# EAGLE design CircuitDiagram (EAGLE 9.3.0)
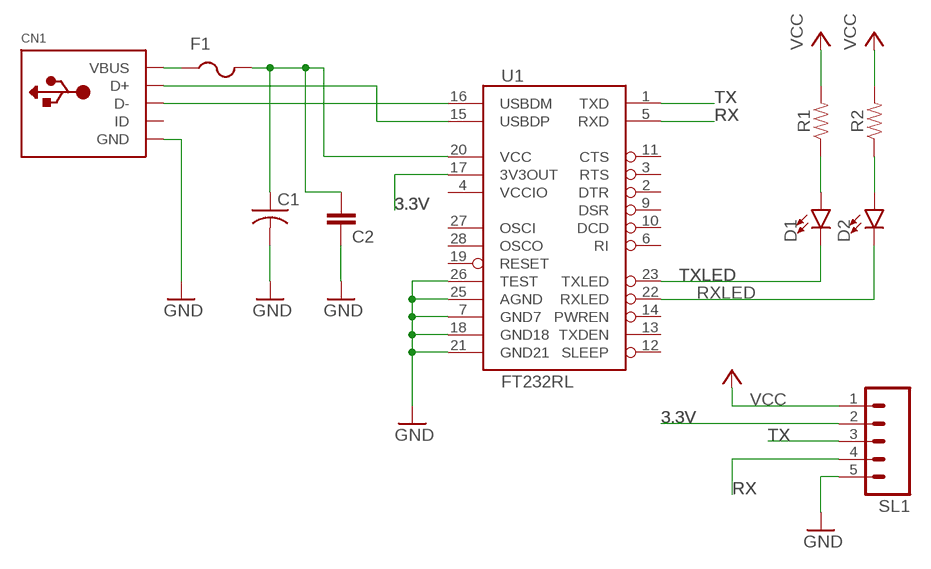
[diagram p0: schematic, sheet 1]

## Parts
C1  C-USC1206  [C1206]
C2  1.0uF  1.0UF-1206-50V-10%  [1206]
CN1  USBMINIB  [USB-MINIB]
D1  LED1206  [LED-1206]
D2  LED1206  [LED-1206]
F1  PTCFUSE-1206  [R1206]
R1  RESISTOR1206  [1206]
R2  RESISTOR1206  [1206]
SL1  M05  [05P]
U1  FT232RL  FT232RLSSOP  [SSOP28DB]

## Nets
3.3V: SL1.2 U1.17(3V3OUT)
GND: C1.2 C2.2 CN1.GND SL1.5 U1.7(GND7) U1.18(GND18) U1.21(GND21) U1.25(AGND) U1.26(TEST)
N$1: CN1.VBUS F1.1
N$2: C1.1 C2.1 F1.2 U1.20(VCC)
N$4: CN1.D- U1.16(USBDM)
N$5: CN1.D+ U1.15(USBDP)
N$6: D1.A R1.1
N$8: D2.A R2.1
RX: SL1.4 U1.5(RXD)
RXLED: D2.C U1.22(RXLED)
TX: SL1.3 U1.1(TXD)
TXLED: D1.C U1.23(TXLED)
VCC: R1.2 R2.2 SL1.1
Unconnected: CN1.ID U1.2(DTR) U1.3(RTS) U1.6(RI) U1.9(DSR) U1.10(DCD) U1.11(CTS) U1.12(SLEEP) U1.13(TXDEN) U1.14(PWREN) U1.19(RESET) U1.27(OSCI) U1.28(OSCO)

## Power pins joined to a net without a drawn wire
VCCIO: U1.4(VCCIO)

## Library data of the parts
C1 = adafruit:C-US: CAPACITOR, American symbol
C2 = SparkFun-Capacitors:1.0UF: 1µF ceramic capacitors A capacitor is a passive two-terminal electrical component used to store electrical energy temporarily in an electric field.; PROD_ID: CAP-09822
CN1 = adafruit:USB: USB Connectors USBMINIB - Surface Mount Female Mini-B USB Connector 4UConnector: 06564 By microbuilder.eu Thru-hole RA Female Mini-B USB Connector 4UConnector: 18732 By ladyada.net
D1 D2 = SparkFun-LED:LED: LED (Generic) Standard schematic elements and footprints for 5mm, 3mm, 1206, and 0603 sized LEDs. Generic LEDs with no color specified.
F1 = adafruit:PTCFUSE: PTC fuses, resettable thermistors
R1 R2 = SparkFun-Resistors:RESISTOR: Generic Resistor Package
SL1 = con-amp-quick:M05: AMP QUICK CONNECTOR; OC_FARNELL: unknown; OC_NEWARK: unknown
U1 = SparkFun-IC-Comms:FT232RL: FT232RL USB UART FT232RL 4th Generation USB UART (USB <-> Serial) Controller. Datasheet <http://www.sparkfun.com/datasheets/IC/FT232R_v104.pdf> SparkFun Products Component <https://www.sparkfun.com/products/650> (COM-00650) SparkFun RedBot Mainboard <https://www.sparkfun.com/products/12097> (ROB-12097) SparkFun FTDI Basic Breakout - 5V <https://www.sparkfun.com/products/9716> (DEV-09716) SparkFun FTDI Basic Breakout - 3.3V <https://www.sparkfun.com/products/9873> (DEV-09873) Bus Pirate - v3.6a <https://www.sparkfun.com/products/12942> (TOL-12942) SparkFun USB to Serial Breakout - FT232RL <https://www.sparkfun.com/products/12731> (BOB-12731) SparkFun PicoBoard <https://www.sparkfun.com/products/11888> (WIG-11888) SparkFun RFID USB Reader <https://www.sparkfun.com/products/9963> (SEN-09963) LilyPad FTDI Basic Breakout - 5V <https://www.sparkfun.com/products/10275> (DEV-10275) SparkFun Stepoko <https://www.sparkfun.com/products/13899> (ROB-13899); PROD_ID: IC-00870

## Board
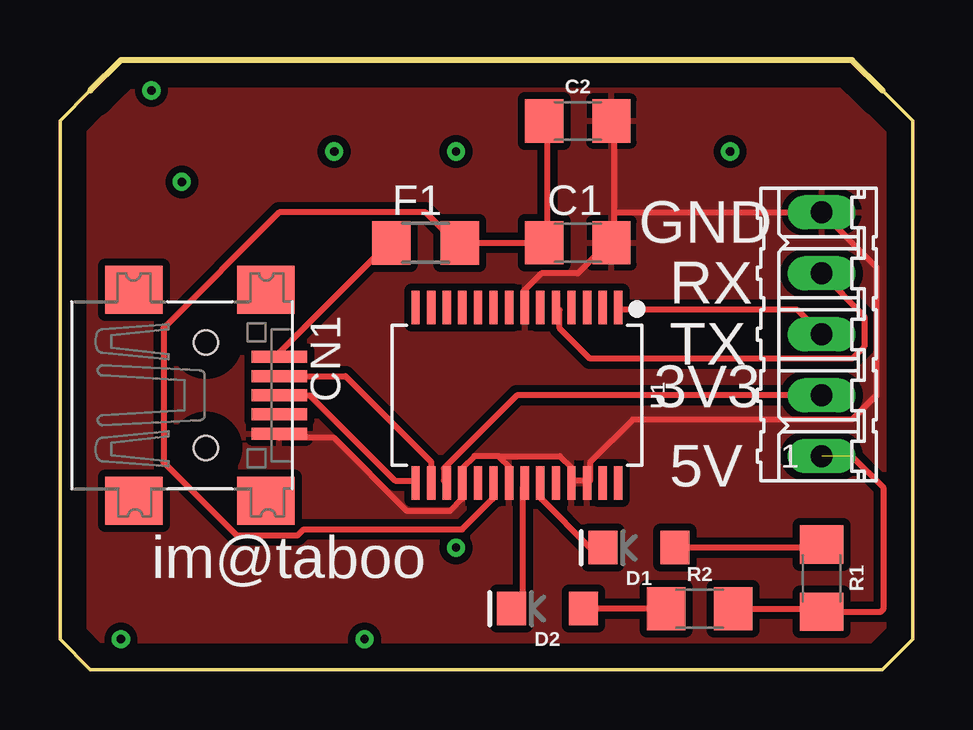
[diagram p1: board, top side]

Size 35.56 x 25.4 mm. Coordinates in mm from the lower left corner, seen from the top.
Outline: 0,22.86 0,1.27 1.27,0 34.29,0 35.56,1.27 35.56,22.86 34.29,24.13 33.02,25.4 2.54,25.4 1.27,24.13 0,22.86
Copper layers (1*16): Top 0.035mm / dielectric 1.5mm / Bottom 0.035mm
Design rules "default *": minimum track width 10mil, minimum drill 0.35mm, track to track 10mil, track to pad 6mil, pad to pad 6mil, via to via 6mil, smd to smd 6mil, copper to edge 40mil, drill to drill 6mil, minimum pad ring 10mil, minimum via ring 8mil, stop-mask expansion 4mil, vias tented up to drill 0mil, thermal gap 10mil

### Footprints (pad centres in the part's own frame; a part is rotated, then mirrored left to right if it is on the bottom)
C1206 = smd 1.6 x 1.8: 1 -1.4,0; 2 1.4,0
1206 = smd 1.6 x 1.8: 1 -1.4,0; 2 1.4,0
USB-MINIB = smd 0.5 x 2.308: D+ 0,4.064; D- -0.8,4.064; GND 1.6,4.064; ID 0.8,4.064; VBUS -1.6,4.064 | smd 2 x 2.4: GND1 -4.4,-2; GND2 -4.4,3.5; GND3 4.4,3.5; GND4 4.4,-2 | hole 1: -2.2,1; 2.2,1
LED-1206 = smd 1.2 x 1.4: A -1.5,0; C 1.5,0
R1206 = smd 1.6 x 1.803: 1 -1.422,0; 2 1.422,0
05P = drill 0.914 long: 1 -5.08,0; 2 -2.54,0; 3 0,0; 4 2.54,0; 5 5.08,0
SSOP28DB = smd 0.348 x 1.397: 1 -4.225,-3.656; 2 -3.575,-3.656; 3 -2.925,-3.656; 4 -2.275,-3.656; 5 -1.625,-3.656; 6 -0.975,-3.656; 7 -0.325,-3.656; 8 0.325,-3.656; 9 0.975,-3.656; 10 1.625,-3.656; 11 2.275,-3.656; 12 2.925,-3.656; 13 3.575,-3.656; 14 4.225,-3.656; 15 4.225,3.656; 16 3.575,3.656; 17 2.925,3.656; 18 2.275,3.656; 19 1.625,3.656; 20 0.975,3.656; 21 0.325,3.656; 22 -0.325,3.656; 23 -0.975,3.656; 24 -1.625,3.656; 25 -2.275,3.656; 26 -2.925,3.656; 27 -3.575,3.656; 28 -4.225,3.656

### Placement (x,y rotation side)
C1  21.59,17.78 0 top
C2  21.59,22.86 0 top
CN1  5.08,11.43 270 top
D1  24.13,5.08 180 top
D2  20.32,2.54 180 top
F1  15.24,17.78 0 top
R1  31.75,3.81 270 top
R2  26.67,2.54 0 top
SL1  31.75,13.97 90 top
U1  19.05,11.43 180 top

### Tracks (layer width: path | path; a pad name or v marks a point on that pad's centre or on a via)
3.3V
  Top 0.254: SL1.2 19.05,11.43 16,8.38 16,7.87 U1.17
GND
  Top 0.254: 21.34,7.87 21.84,7.87 U1.26 22.1,7.87 22.1,8.64 23.88,10.41 33.02,10.41 34.04,11.43 34.04,16.76 SL1.5 23.11,19.05 | 18.29,8.89 17.27,8.89 16.76,8.38 16.76,7.87 U1.18 16.76,7.62 16.76,7.11 16.26,6.6 14.48,6.6 11.43,9.65 9.14,9.65 CN1.GND | 18.29,8.89 18.8,8.38 18.8,7.87 U1.21 | 21.34,7.87 21.34,8.38 20.83,8.89 18.29,8.89 | 21.34,7.87 U1.25 | U1.7 19.3,15.24 19.3,15.75 20.07,16.51 21.59,16.51 22.86,17.78 C1.2 23.11,17.78 23.11,19.05 | 23.11,19.05 23.11,22.86 C2.2
  pour Top (isolate 0.305): 2.54,25.4 0,22.86 0,1.27 1.27,0 34.29,0 35.56,1.27 35.56,22.86 33.02,25.4
N$1
  Top 0.254: F1.1 13.72,17.78 9.14,13.21 CN1.VBUS
N$2
  Top 0.254: U1.20 18.03,7.62 18.03,7.11 16.76,5.84 10.16,5.84 9.91,5.59 7.37,5.59 4.32,8.64 4.32,14.22 9.14,19.05 15.24,19.05 16.51,17.78 F1.2 C1.1 20.32,17.78 20.32,22.86 C2.1
N$3  (via drill 0.35)
  other vias: 5.08,20.32
N$4
  Top 0.254: CN1.D- 11.9,12.23 15.47,8.66 U1.16
N$5
  Top 0.254: CN1.D+ 10.41,11.43 13.97,7.87 14.73,7.87 U1.15
N$6
  Top 0.254: D1.A 31.75,5.08 R1.1
N$7  (via drill 0.35)
  other vias: 2.54,1.27
N$8
  Top 0.254: R2.1 D2.A
N$9  (via drill 0.35)
  other vias: 12.7,1.27
N$10  (via drill 0.35)
  other vias: 16.51,5.08
N$11  (via drill 0.35)
  other vias: 11.43,21.59
N$12  (via drill 0.35)
  other vias: 16.51,21.59
N$13  (via drill 0.35)
  other vias: 27.94,21.59
N$14  (via drill 0.35)
  other vias: 3.81,24.13
RX
  Top 0.254: SL1.4 33.53,14.73 33.53,13.46 33.02,12.95 22.1,12.95 20.83,14.22 20.83,14.99 U1.5
RXLED
  Top 0.254: U1.22 19.3,7.62 19.3,2.79 19.05,2.54 D2.C
TX
  Top 0.254: SL1.3 30.73,14.99 23.37,14.99 U1.1
TXLED
  Top 0.254: D1.C 22.1,5.08 20.07,7.11 20.07,7.62 U1.23
VCC  (1 unrouted)
  Top 0.254: R2.2 31.75,2.54 R1.2 34.21,2.41 34.34,2.54 34.34,7.57 33.02,8.89

### Text on the board
tNames: GND | RX | TX | 3V3 | 5V | im@taboo